# EasyEDA Pro project PCB4_1.epro

# Board PCB4_1
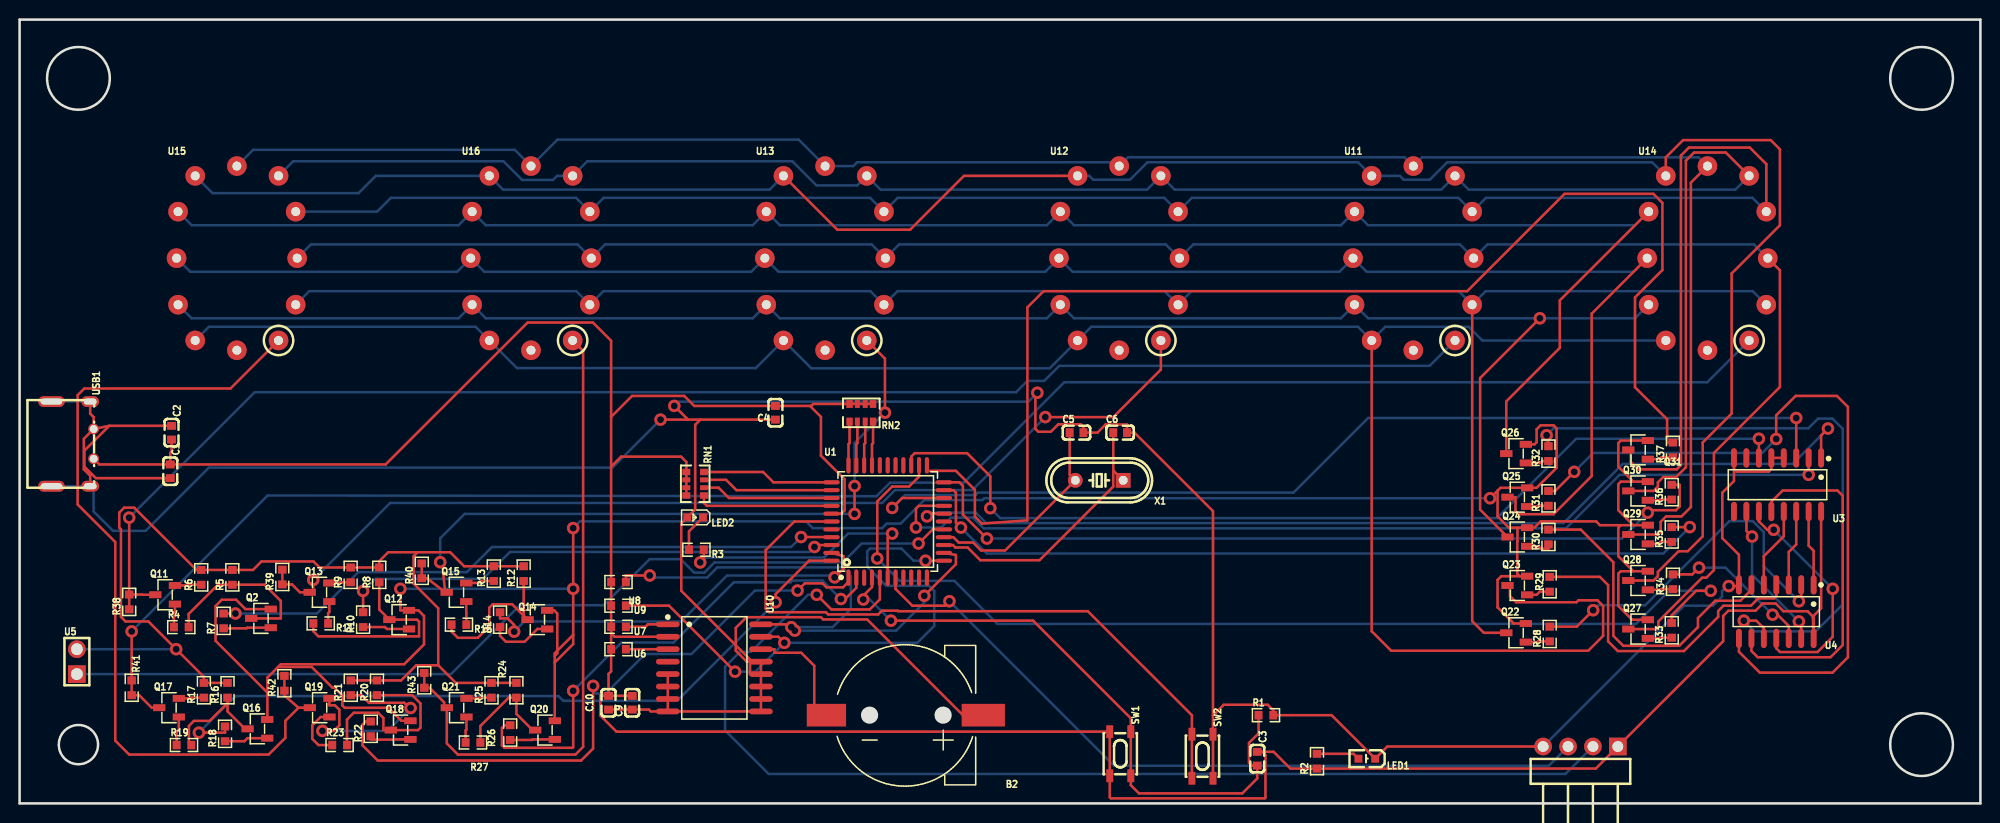
[diagram p0: board, top side]
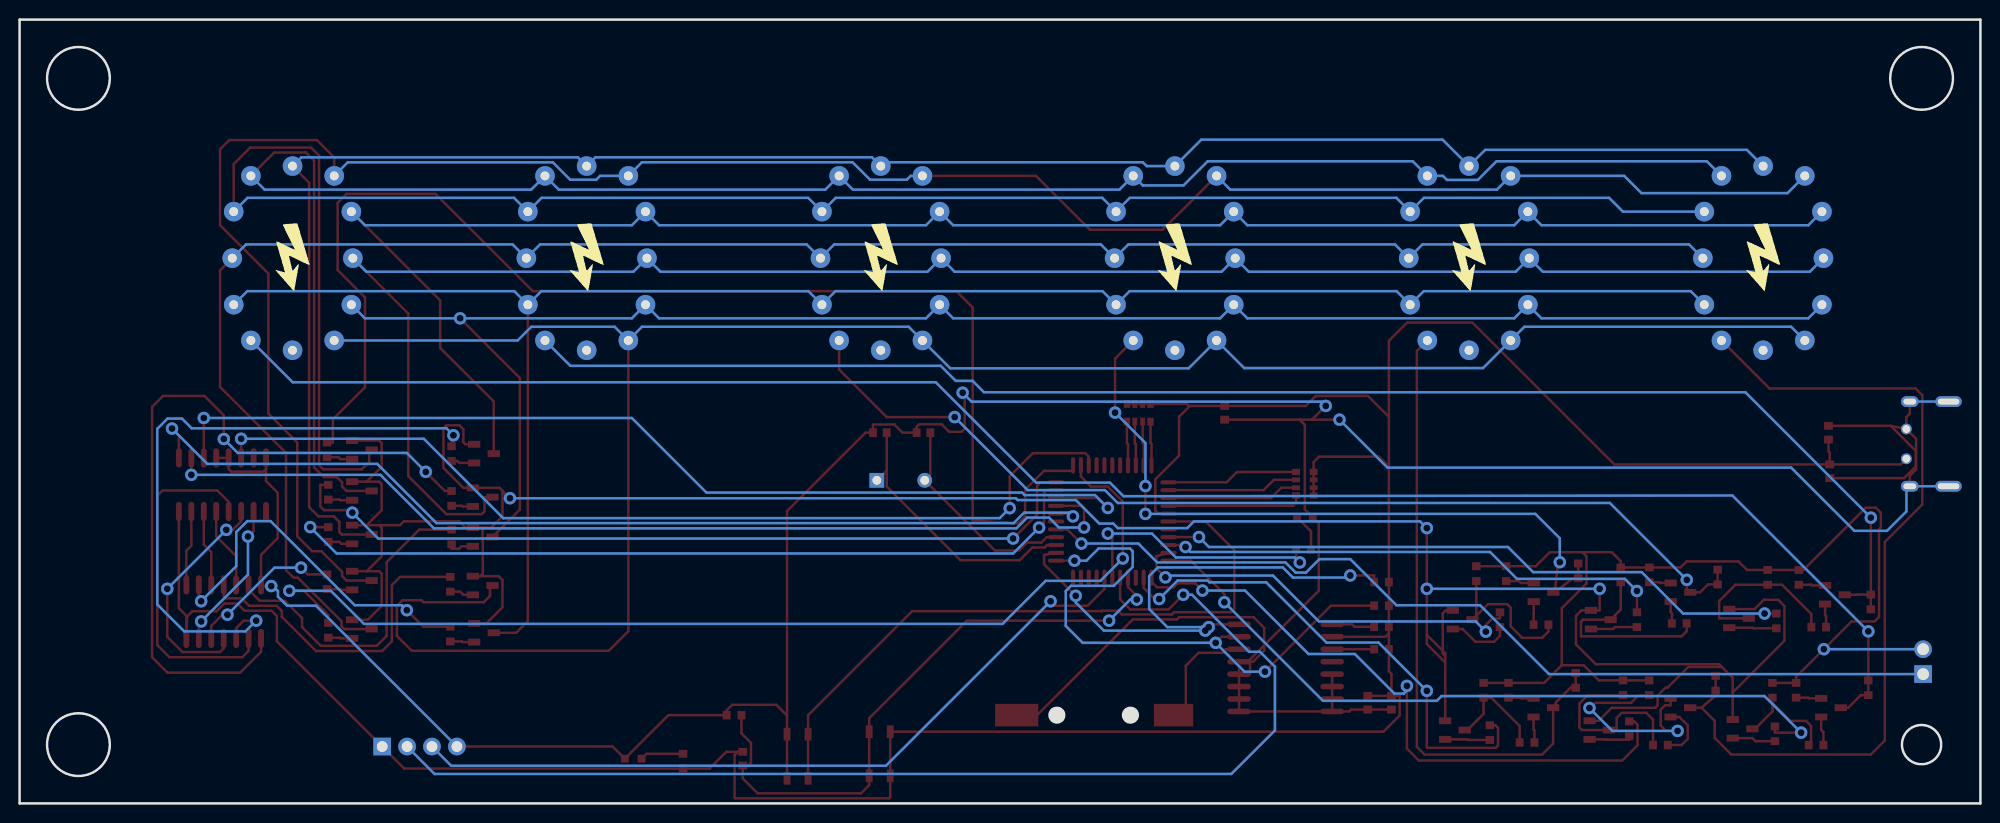
[diagram p1: board, bottom side, seen from below]

Outline 200 x 80 mm; copper layers: Top Layer, Bottom Layer. Coordinates in mm from the lower left corner of the outline.
Outline path: circle c6,74 r3.2 ; circle c6,6 r2 ; circle c86.7,9.01 r0.75 ; circle c94.2,9.01 r0.75 ; circle c194,74 r3.2 ; circle c194,6 r3.2 ; 0,80 0,0 200,0 200,80 0,80
Stack: Top Layer 0.0356mm / Dielectric1 0.32mm FR-4 er 4.8 / Bottom Layer 0.0356mm

## Design rules (mm)
spacing Clearance (default): track to track 0.254, other pairs 0 to 0.254
track width Width (default): min 0.254, default 0.254, max 0.254
differential pair DiffPairsRouting (default): width min 0.381, default 0.381, max 0.381; gap min 0.254, default 0.254
via RoutingVias (default): diameter min 1.27, default 1.27, max 1.27; hole min 0.711, default 0.711, max 0.711

## Placement (name value [footprint] x y rotation side)
B2  CR1220-2  [BAT-SMD_CR1220-2]  90.3 9.01 180 top
C1  CL10A106MP8NNNC  [C0603]  15.37 33.9 270 top
C2  CL10B104KB8NNNC  [C0603]  15.49 37.84 270 top
C3  CL10A106MP8NNNC  [C0603]  126.24 4.56 270 top
C4  CL10B104KB8NNNC  [C0603]  77.09 39.87 270 top
C5  0603CG220J500NT  [C0603]  107.81 37.84 0 top
C6  0603CG220J500NT  [C0603]  112.25 37.84 0 top
C9  CL10A105KB8NNNC  [C0603]  62.48 10.28 90 top
C10  CC0603KRX7R9BB104  [C0603]  60.07 10.28 90 top
H1  DZ254W-11-04-65  [HDR-TH_4P-P2.54-H-M-W10.3]  159.21 5.81 180 top
LED1  19-217/R6C-AL1M2VY/3T  [LED0603-R-RD]  137.41 4.56 180 top
LED2  LED_0603-B  [LED0603-RD_BLUE]  68.91 29.2 180 top
Q2  MMBTA42_C916394  [SOT-23-3_L2.9-W1.3-P1.90-LS2.4-BR]  24.62 18.88 0 top
Q11  MMBTA92_C916395  [SOT-23-3_L2.9-W1.3-P1.90-LS2.4-BR]  14.84 21.29 0 top
Q12  MMBTA42_C916394  [SOT-23-3_L2.9-W1.3-P1.90-LS2.4-BR]  38.72 18.75 0 top
Q13  MMBTA92_C916395  [SOT-23-3_L2.9-W1.3-P1.90-LS2.4-BR]  30.59 21.55 0 top
Q14  MMBTA42_C916394  [SOT-23-3_L2.9-W1.3-P1.90-LS2.4-BR]  52.81 18.75 0 top
Q15  MMBTA92_C916395  [SOT-23-3_L2.9-W1.3-P1.90-LS2.4-BR]  44.56 21.55 0 top
Q16  MMBTA42_C916394  [SOT-23-3_L2.9-W1.3-P1.90-LS2.4-BR]  24.26 7.61 0 top
Q17  MMBTA92_C916395  [SOT-23-3_L2.9-W1.3-P1.90-LS2.4-BR]  15.24 9.77 0 top
Q18  MMBTA42_C916394  [SOT-23-3_L2.9-W1.3-P1.90-LS2.4-BR]  38.86 7.48 0 top
Q19  MMBTA92_C916395  [SOT-23-3_L2.9-W1.3-P1.90-LS2.4-BR]  30.61 9.77 0 top
Q20  MMBTA42_C916394  [SOT-23-3_L2.9-W1.3-P1.90-LS2.4-BR]  53.59 7.48 0 top
Q21  MMBTA92_C916395  [SOT-23-3_L2.9-W1.3-P1.90-LS2.4-BR]  44.58 9.77 0 top
Q22  MMBTA42_C916394  [SOT-23-3_L2.9-W1.3-P1.90-LS2.4-BR]  152.64 17.41 0 top
Q23  MMBTA42_C916394  [SOT-23-3_L2.9-W1.3-P1.90-LS2.4-BR]  152.77 22.24 0 top
Q24  MMBTA42_C916394  [SOT-23-3_L2.9-W1.3-P1.90-LS2.4-BR]  152.77 27.19 0 top
Q25  MMBTA42_C916394  [SOT-23-3_L2.9-W1.3-P1.90-LS2.4-BR]  152.77 31.26 0 top
Q26  MMBTA42_C916394  [SOT-23-3_L2.9-W1.3-P1.90-LS2.4-BR]  152.64 35.7 0 top
Q27  MMBTA42_C916394  [SOT-23-3_L2.9-W1.3-P1.90-LS2.4-BR]  165.08 17.8 0 top
Q28  MMBTA42_C916394  [SOT-23-3_L2.9-W1.3-P1.90-LS2.4-BR]  165.08 22.75 0 top
Q29  MMBTA42_C916394  [SOT-23-3_L2.9-W1.3-P1.90-LS2.4-BR]  165.08 27.45 0 top
Q30  MMBTA42_C916394  [SOT-23-3_L2.9-W1.3-P1.90-LS2.4-BR]  165.08 31.89 0 top
Q31  MMBTA42_C916394  [SOT-23-3_L2.9-W1.3-P1.90-LS2.4-BR]  165.08 36.08 0 top
R1  RC0603JR-0710KL  [R0603]  127.13 9.01 0 top
R2  RC0603JR-0710KL  [R0603]  132.33 4.31 90 top
R3  RC0603JR-0710KL  [R0603]  69.03 25.89 180 top
R4  Res_0603  [R0603]  16.49 17.99 0 top
R5  Res_0603  [R0603]  21.7 23.07 90 top
R6  Res_0603  [R0603]  18.52 23.07 90 top
R7  Res_0603  [R0603]  20.81 18.63 90 top
R8  Res_0603  [R0603]  36.69 23.33 90 top
R9  Res_0603  [R0603]  33.76 23.33 90 top
R10  Res_0603  [R0603]  35.03 18.75 90 top
R11  Res_0603  [R0603]  30.72 18.37 180 top
R12  Res_0603  [R0603]  51.42 23.45 90 top
R13  Res_0603  [R0603]  48.37 23.45 90 top
R14  Res_0603  [R0603]  49 18.75 90 top
R15  Res_0603  [R0603]  44.81 18.25 180 top
R16  Res_0603  [R0603]  21.21 11.55 90 top
R17  Res_0603  [R0603]  18.8 11.55 90 top
R18  Res_0603  [R0603]  20.95 7.1 90 top
R19  Res_0603  [R0603]  16.76 5.96 0 top
R20  Res_0603  [R0603]  36.45 11.8 90 top
R21  Res_0603  [R0603]  33.78 11.8 90 top
R22  Res_0603  [R0603]  35.81 7.61 90 top
R23  Res_0603  [R0603]  32.64 5.96 0 top
R24  Res_0603  [R0603]  50.67 11.55 90 top
R25  Res_0603  [R0603]  48.13 11.55 90 top
R26  Res_0603  [R0603]  50.04 7.23 90 top
R27  Res_0603  [R0603]  46.24 6.22 0 top
R28  Res_0603  [R0603]  156.07 17.29 90 top
R29  Res_0603  [R0603]  156.07 22.37 90 top
R30  Res_0603  [R0603]  155.94 27.19 90 top
R31  Res_0603  [R0603]  155.94 31.13 90 top
R32  Res_0603  [R0603]  155.94 35.7 90 top
R33  Res_0603  [R0603]  168.51 17.67 90 top
R34  Res_0603  [R0603]  168.64 22.62 90 top
R35  Res_0603  [R0603]  168.51 27.45 90 top
R36  Res_0603  [R0603]  168.51 31.77 90 top
R37  Res_0603  [R0603]  168.64 36.08 90 top
R38  0603WAF1002T5E  [R0603]  11.18 20.56 90 top
R39  0603WAF1002T5E  [R0603]  26.8 23.1 90 top
R40  0603WAF1002T5E  [R0603]  41.02 23.74 90 top
R41  0603WAF1002T5E  [R0603]  11.43 11.8 270 top
R42  0603WAF1002T5E  [R0603]  27.01 12.26 90 top
R43  0603WAF1002T5E  [R0603]  41.27 12.56 90 top
RN1  yc164-jr-0710kl  [res-array-smd_0603-8p-l3.2-w1.6-bl]  68.91 32.62 270 top
RN2  yc164-jr-0710kl  [res-array-smd_0603-8p-l3.2-w1.6-bl]  85.85 39.87 180 top
SW1  PTS815SJK250SMTRLFS  [SW-SMD_4P-L4.2-W3.3-P2.15-LS5.1]  112.27 5.07 270 top
SW2  PTS815SJK250SMTRLFS  [SW-SMD_4P-L4.2-W3.3-P2.15-LS5.1]  120.65 4.82 270 top
U1  STC89C52RC-40I  [LQFP-44_L10.0-W10.0-P0.80-LS12.0-BL]  88.55 28.77 0 top
U3  74HC138D_C5205140  [SOIC-16_L9.9-W3.9-P1.27-LS6.0-BL]  179.31 32.53 180 top
U4  CD4069_C3041279  [SOP-14_L8.8-W3.9-P1.27-LS6.0-BL]  179.18 19.57 180 top
U5  54102-T0600LF  [HDR-TH_2P-P2.54-V-M-R2-C1-S2.54]  5.84 14.47 0 top
U6  AR03FTDX4701A  [R0603]  61.09 15.74 180 top
U7  AR03FTDX4701A  [R0603]  61.09 18.02 180 top
U8  AR03FTDX4701A  [R0603]  61.09 22.6 180 top
U9  AR03FTDX4701A  [R0603]  61.09 20.18 180 top
U10  DS3231SN#  [SOIC-16_L10.3-W7.5-P1.27-LS10.3-BL]  70.87 13.83 270 top
U11  IN-12A  [IN-12]  142.16 55.65 0 top
U12  IN-12A  [IN-12]  112.16 55.65 0 top
U13  IN-12A  [IN-12]  82.16 55.65 0 top
U14  IN-12A  [IN-12]  172.16 55.65 0 top
U15  IN-12A  [IN-12]  22.16 55.65 0 top
U16  IN-12A  [IN-12]  52.16 55.65 0 top
USB1  TYPE-C-31-M-33  [USB-C-TH_TYPE-C-31-M-33]  5.4 36.69 270 top
X1  B11059J019  [HC-49US_L11.5-W4.5-P4.88]  110.12 32.98 180 top

## Footprints (pads in the part's own frame, mm; a bottom-side part is the same pattern mirrored in y, then rotated)
BAT-SMD_CR1220-2
  rect 4.4x2.3 smd: 1(-8,0)
  rect 4x2.3 smd: 2(8,0)
C0603
  rect 0.8x0.9 smd: 1(-0.7,0) 2(0.7,0)
HC-49US_L11.5-W4.5-P4.88
  rect 1.501x1.501 hole 0.899: 1(-2.441,0)
  round 1.501 hole 0.899: 2(2.441,0)
HDR-TH_2P-P2.54-V-M-R2-C1-S2.54
  rect 1.8x1.8 hole 1.2: 1(0,-1.27)
  round 1.8 hole 1.2: 2(0,1.27)
HDR-TH_4P-P2.54-H-M-W10.3
  rect 1.8x1.8 hole 1.1: 1(-3.81,0)
  round 1.8 hole 1.1: 2(-1.27,0) 3(1.27,0) 4(3.81,0)
IN-12
  round 2 hole 0.914: Hi(4.25,-8.4) N0(6,-4.75) N1(-4.25,-8.4) N2(-6,-4.75) N3(-6.15,0) N4(-6,4.75) N5(-4.25,8.4) N6(0,9.4) N7(4.25,8.4) N8(6,4.75) N9(6.15,0) P(0,-9.4)
LED0603-R-RD
  rect 0.8x0.8 smd: 1(0.851,0) 2(-0.851,0)
LED0603-RD_BLUE
  rect 0.8x0.8 smd: 1(-0.8,-0.003) 2(0.8,0.003)
LQFP-44_L10.0-W10.0-P0.80-LS12.0-BL
  oval 0.419x1.669 smd: 1(-4,-5.736) 2(-3.2,-5.736) 3(-2.401,-5.736) 4(-1.6,-5.736) 5(-0.8,-5.736) 6(0,-5.736) 7(0.8,-5.736) 8(1.6,-5.736) 9(2.401,-5.736) 10(3.2,-5.736) 11(4,-5.736) 23(4,5.736) 24(3.2,5.736) 25(2.401,5.736) 26(1.6,5.736) 27(0.8,5.736) 28(0,5.736) 29(-0.8,5.736) 30(-1.6,5.736) 31(-2.401,5.736) 32(-3.2,5.736) 33(-4,5.736)
  oval 1.669x0.419 smd: 12(5.736,-4) 13(5.736,-3.2) 14(5.736,-2.401) 15(5.736,-1.6) 16(5.736,-0.8) 17(5.736,0) 18(5.736,0.8) 19(5.736,1.6) 20(5.736,2.401) 21(5.736,3.2) 22(5.736,4) 34(-5.736,4) 35(-5.736,3.2) 36(-5.736,2.401) 37(-5.736,1.6) 38(-5.736,0.8) 39(-5.736,0) 40(-5.736,-0.8) 41(-5.736,-1.6) 42(-5.736,-2.401) 43(-5.736,-3.2) 44(-5.736,-4)
R0603
  rect 0.806x0.864 smd: 1(-0.753,0) 2(0.753,0)
res-array-smd_0603-8p-l3.2-w1.6-bl
  rect 0.65x0.8 smd: 1(-1.199,-0.899) 4(1.199,-0.899) 5(1.199,0.899) 8(-1.199,0.899)
  rect 0.5x0.8 smd: 2(-0.399,-0.899) 3(0.402,-0.899) 6(0.402,0.899) 7(-0.399,0.899)
SOIC-16_L9.9-W3.9-P1.27-LS6.0-BL
  oval 0.602x1.971 smd: 1(-4.445,-2.736) 2(-3.175,-2.736) 3(-1.905,-2.736) 4(-0.635,-2.736) 5(0.635,-2.736) 6(1.905,-2.736) 7(3.175,-2.736) 8(4.445,-2.736) 9(4.445,2.736) 10(3.175,2.736) 11(1.905,2.736) 12(0.635,2.736) 13(-0.635,2.736) 14(-1.905,2.736) 15(-3.175,2.736) 16(-4.445,2.736)
SOIC-16_L10.3-W7.5-P1.27-LS10.3-BL
  oval 0.574x2.401 smd: 1(-4.445,-4.75) 2(-3.175,-4.75) 3(-1.905,-4.75) 4(-0.635,-4.75) 5(0.635,-4.75) 6(1.905,-4.75) 7(3.175,-4.75) 8(4.445,-4.75) 9(4.445,4.75) 10(3.175,4.75) 11(1.905,4.75) 12(0.635,4.75) 13(-0.635,4.75) 14(-1.905,4.75) 15(-3.175,4.75) 16(-4.445,4.75)
SOP-14_L8.8-W3.9-P1.27-LS6.0-BL
  oval 0.595x1.968 smd: 1(-3.81,-2.734) 2(-2.54,-2.734) 3(-1.27,-2.734) 4(0,-2.734) 5(1.27,-2.734) 6(2.54,-2.734) 7(3.81,-2.734) 8(3.81,2.733) 9(2.54,2.733) 10(1.27,2.733) 11(0,2.733) 12(-1.27,2.733) 13(-2.54,2.733) 14(-3.81,2.733)
SOT-23-3_L2.9-W1.3-P1.90-LS2.4-BR
  rect 1.25x0.7 smd: 1(1,-0.95) 2(1,0.95) 3(-1,0)
SW-SMD_4P-L4.2-W3.3-P2.15-LS5.1
  rect 1.3x0.701 smd: 1(-2.251,1.075) 2(2.251,1.075) 3(-2.251,-1.075) 4(2.251,-1.075)
USB-C-TH_TYPE-C-31-M-33
  oval 1.1x1.8 hole 0.6x1.3: 3(4.32,1.8) 6(-4.32,1.8)
  oval 1.1x2.7 hole 0.6x2.2: 4(4.32,-2.15) 5(-4.32,-2.15)
  round 1.1 hole 0.8: A9(1.52,2.15) B12(-1.52,2.15)

## Nets
+5V: C1.1 C2.2 C3.1 C4.1 C9.2 C10.2 H1.1 R2.1 RN1.1 RN1.2 RN1.3 RN1.4 RN2.1 RN2.2 RN2.3 RN2.4 SW1.3 SW1.4 U1.38 U3.16 U4.14 U6.2 U7.2 U8.2 U9.2 U10.2 USB1.A9
GND: U1.16 U5.1
GND1: Q2.2 Q12.2 Q14.2 Q16.2 Q18.2 Q20.2 Q22.2 Q23.2 Q24.2 Q25.2 Q26.2 Q27.2 Q28.2 Q29.2 Q30.2 Q31.2
GND2: B2.1 C1.2 C2.1 C4.2 C5.2 C6.2 C9.1 C10.1 H1.4 LED1.2 LED2.2 R1.2 SW2.1 SW2.2 U3.4 U3.5 U3.8 U4.7 U10.5 U10.6 U10.7 U10.8 U10.9 U10.10 U10.11 U10.12 U10.13 USB1.3 USB1.4 USB1.5 USB1.6 USB1.B12
VCC: R5.2 R6.2 R8.2 R9.2 R12.2 R13.2 R16.2 R17.2 R20.2 R21.2 R24.2 R25.2 U5.2
32K: U7.1 U10.1
BAT: B2.2 U10.14
CN0: R28.2 U4.2
CN1: R29.2 U4.4
CN2: R30.2 U4.6
CN3: R31.2 U4.8
CN4: R32.2 U4.10
CN5: R34.2 U4.12
HC0: U3.15 U4.1
HC1: U3.14 U4.3
HC2: U3.13 U4.5
HC3: U3.12 U4.9
HC4: U3.11 U4.11
HC5: U3.10 U4.13
HC6: U3.9
NO0: Q22.3 U11.N0 U12.N0 U13.N0 U14.N0 U15.N0 U16.N0
NO1: Q23.3 U11.N1 U12.N1 U13.N1 U14.N1 U15.N1 U16.N1
NO2: Q24.3 U11.N2 U12.N2 U13.N2 U14.N2 U15.N2 U16.N2
NO3: Q25.3 U11.N3 U12.N3 U13.N3 U14.N3 U15.N3 U16.N3
NO4: Q26.3 U11.N4 U12.N4 U13.N4 U14.N4 U15.N4 U16.N4
NO5: Q28.3 U11.N5 U12.N5 U13.N5 U14.N5 U15.N5 U16.N5
NO6: Q29.3 U11.N6 U12.N6 U13.N6 U14.N6 U15.N6 U16.N6
NO7: Q30.3 U11.N7 U12.N7 U13.N7 U14.N7 U15.N7 U16.N7
NO8: Q31.3 U11.N8 U12.N8 U13.N8 U14.N8 U15.N8 U16.N8
NO9: Q27.3 U11.N9 U12.N9 U13.N9 U14.N9 U15.N9 U16.N9
O1: Q11.3 R38.1 R38.2 U11.Hi
O2: Q13.3 R39.1 R39.2 U12.Hi
O3: Q15.3 R40.1 R40.2 U13.Hi
O4: Q17.3 R41.1 R41.2 U14.Hi
O5: Q19.3 R42.1 R42.2 U15.Hi
O6: Q21.3 R43.1 R43.2 U16.Hi
P0.0: RN1.5 U1.37
P0.1: RN1.6 U1.36
P0.2: RN1.7 U1.35
P0.3: RN1.8 U1.34
P0.4: RN2.5 U1.33
P0.5: RN2.6 U1.32
P0.6: RN2.7 U1.31
P0.7: RN2.8 U1.30
P1.0: U1.40
P1.1: R7.2 U1.41
P1.2: R10.2 U1.42
P1.3: R14.2 U1.43
P1.4: R18.2 U1.44
P1.5: R22.2 U1.1
P1.6: R26.2 U1.2
P1.7: U1.3
P2.0: U1.18 U3.1
P2.1: U1.19 U3.2
P2.2: U1.20 U3.3
P2.3: R35.2 U1.21
P2.4: R36.2 U1.22
P2.5: R37.2 U1.23
P2.6: R33.2 U1.24
P2.7: U1.25 U3.6
P3.0: H1.2 U1.5
P3.1: H1.3 U1.7
P3.2: U1.8
P3.3: U1.9
P3.4: U1.10
P3.5: U1.11
P3.6: U1.12 U9.1 U10.15
P3.7: U1.13 U8.1 U10.16
P4.0: U1.17
P4.1: U1.28
P4.2: SW2.3 SW2.4 U1.39
P4.3: R3.1 U1.6
P4.4: U1.26
P4.5: U1.27
P4.6: U1.29
RST: C3.2 R1.1 SW1.1 SW1.2 U1.4
SQW: U6.1 U10.3
XTAL1: C5.1 U1.15 X1.2
XTAL2: C6.1 U1.14 X1.1
$1N1351: LED1.1 R2.2
$1N1355: LED2.1 R3.2
$1N2619: Q11.2 R6.1
$1N2621: Q2.1 R7.1
$1N2624: Q2.3 R4.2 R5.1
$1N2625: Q11.1 R4.1
$1N3048: Q13.2 R9.1
$1N3050: Q12.1 R10.1
$1N3052: Q12.3 R8.1 R11.2
$1N3053: Q13.1 R11.1
$1N3261: Q15.2 R13.1
$1N3263: Q14.1 R14.1
$1N3265: Q14.3 R12.1 R15.2
$1N3266: Q15.1 R15.1
$1N3474: Q17.2 R17.1
$1N3476: Q16.1 R18.1
$1N3478: Q16.3 R16.1 R19.2
$1N3479: Q17.1 R19.1
$1N3687: Q19.2 R21.1
$1N3689: Q18.1 R22.1
$1N3691: Q18.3 R20.1 R23.2
$1N3692: Q19.1 R23.1
$1N3900: Q21.2 R25.1
$1N3902: Q20.1 R26.1
$1N3904: Q20.3 R24.1 R27.2
$1N3905: Q21.1 R27.1
$1N4218: Q22.1 R28.1
$1N4332: Q23.1 R29.1
$1N4415: Q24.1 R30.1
$1N4498: Q25.1 R31.1
$1N4581: Q26.1 R32.1
$1N4664: Q27.1 R33.1
$1N4747: Q28.1 R34.1
$1N4830: Q29.1 R35.1
$1N4913: Q30.1 R36.1
$1N4996: Q31.1 R37.1

Pads without a net: U3 7; U10 4; U11 P; U12 P; U13 P; U14 P; U15 P; U16 P

## Via types
v1: diameter 1.27, hole 0.711, Top Layer to Bottom Layer, 72 vias

## Routing (per net, layer and track width the routed paths; a pad name or vN(x,y) marks a point on that pad's centre or on a via; arc(x,y) is an arc through that point)
+5V: length 325.5
  Top Layer w0.254: C1.1 15.37,35.8 15.49,35.92 C2.2 ; C1.1 37.33,34.6 51.82,49.08 58.47,49.08 60.33,47.22 60.33,39.45 ; C1.1 8.12,34.6 7.55,35.17 ; C10.2 C9.2 ; C10.2 59.23,10.98 59.23,8.97 60.88,7.32 111.19,7.32 SW1.3 SW1.4 111.19,0.64 111.32,0.52 127,0.52 127.08,0.59 127.08,4.93 126.75,5.26 ; C10.2 60.07,13.22 60.33,13.48 U6.2 60.33,17.36 ; 126.75,5.26 127.91,5.26 129.62,3.55 R2.1 160.77,3.55 H1.1 173.76,16.55 173.76,19.13 174.3,19.67 177.06,19.67 177.8,20.4 179.12,20.4 179.91,19.62 182.37,19.62 182.91,19.08 ; 126.75,5.26 C3.1 ; 60.33,17.36 60.68,17.01 U10.2 ; 60.33,17.36 U7.2 U9.2 U8.2 60.33,34.37 ; 60.33,34.37 61.35,35.39 67.46,35.39 68.01,34.85 RN1.1 RN1.2 RN1.3 RN1.4 ; 60.33,34.37 60.33,39.45 ; 182.91,19.08 U4.14 182.99,19 182.91,19.08 ; 182.91,19.08 183.75,19.92 U3.16 ; 80.62,40.57 80.75,40.57 80.95,40.77 87.05,40.77 ; 80.62,40.57 81.74,39.45 81.74,35.49 84.15,33.08 84.15,29.9 83.82,29.57 U1.38 ; 80.62,40.57 C4.1 68.81,40.57 67.79,41.59 62.47,41.59 60.33,39.45
GND: length 95.7
  Top Layer w0.254: v1(91.69,26.53) 93.14,27.97 94.28,27.97
  Bottom Layer w0.254: v1(91.69,26.53) 85.89,26.53 83.96,24.59 70.88,24.59 69.84,23.56 68.79,23.56 67.42,24.93 64.27,24.93 59.56,20.23 51.03,20.23 44,13.2 U5.1
GND1: length 287.2
  Top Layer w0.254: Q20.2 54.58,8.43 54.58,14.38 ; Q14.2 54.52,19.7 54.84,19.39 54.84,15.58 ; v1(56.46,28.1) v1(56.46,21.9) 56.46,17.2 ; 164.59,23.7 163.32,23.7 163.07,23.44 163.07,20.15 164.47,18.75 Q27.2 ; 164.59,23.7 163.07,25.22 163.07,28.14 163.32,28.4 ; 164.59,23.7 Q28.2 ; 152.78,28.14 151.9,28.14 150.75,29.29 150.75,31.91 ; 152.78,28.14 Q24.2 154.51,28.14 155.15,28.79 160.81,28.79 161.2,28.4 163.32,28.4 ; 152.78,28.14 152.78,26.75 152.76,26.73 152.76,23.45 153.02,23.19 ; 150.75,31.91 151.05,32.21 Q25.2 154.73,32.21 156.77,34.25 156.77,38.29 156.46,38.59 155.14,38.59 154.74,38.18 154.74,36.86 154.53,36.65 Q26.2 ; 150.75,31.91 v1(149.99,31.15) ; 26.36,13.93 25.27,12.84 25.27,11.31 ; 26.36,13.93 26.64,14.21 39.23,14.21 41.25,16.23 41.25,19.13 40.68,19.7 Q12.2 38.84,19.7 v1(38.84,21.9) ; 26.36,13.93 29.79,13.93 31.9,11.82 32.11,11.82 32.92,11.01 32.92,10 33.16,9.76 37.61,9.76 38.93,8.43 Q18.2 ; 153.02,23.19 151.13,23.19 150.75,22.81 150.75,20.02 152.4,18.36 Q22.2 ; 153.02,23.19 Q23.2 ; 54.84,15.58 56.46,17.2 ; 54.84,15.58 54.58,15.32 54.58,15.04 ; 54.84,15.58 54.84,15.3 54.58,15.04 ; 56.46,17.2 56.46,16.26 54.58,14.38 ; Q2.2 23.03,19.83 22.08,20.78 20.62,20.78 19.99,20.15 19.99,16.59 25.27,11.31 ; Q31.2 163.32,37.03 163.07,36.78 163.07,34.37 164.59,32.84 ; 54.58,14.38 54.58,15.04 ; 164.59,32.84 163.32,32.84 163.07,32.59 163.07,29.92 164.59,28.4 ; 164.59,32.84 Q30.2 ; 163.32,28.4 164.59,28.4 ; 164.59,28.4 Q29.2 ; Q16.2 25.27,8.56 25.27,11.31
  Bottom Layer w0.254: v1(38.84,21.9) v1(56.46,21.9) ; v1(149.99,31.15) 98.38,31.15 98.2,30.96 92.27,30.96 89.87,28.56 88.45,28.56 87.99,28.1 80.9,28.1 80.21,28.79 57.15,28.79 v1(56.46,28.1)
GND2: length 387.7
  Top Layer w0.254: U10.12 74.5,13.2 74.5,14.47 ; U10.12 U10.13 74.5,14.47 ; U10.12 U10.11 U10.10 U10.9 U10.8 ; 69.44,39.17 C4.2 ; 69.44,39.17 68.91,38.64 68.91,30 LED2.2 67.49,28.58 67.49,21.7 73.05,16.14 ; 69.44,39.17 68.18,39.17 ; U10.8 U10.7 U10.6 U10.5 ; U10.8 64.38,9.39 64.19,9.58 C9.1 C10.1 ; C1.2 7.78,33.2 6.6,34.37 6.6,36 9.14,38.54 ; USB1.6 7.2,39.78 7.55,39.43 7.55,38.21 ; 74.5,14.47 74.17,14.47 73.05,15.59 73.05,16.14 ; 74.5,14.47 74.5,14.69 73.05,16.14 ; 7.2,32.37 7.2,33.45 6.55,34.09 6.55,37.22 7.55,38.21 ; U3.4 U3.5 178.67,34.12 178.42,33.87 175.12,33.87 174.86,34.12 ; 7.55,38.21 9.14,38.54 ; 9.14,38.54 C2.1 ; 73.05,16.14 73.05,17.91 74.14,19.01 81.74,19.01 81.97,18.78 86.45,18.78 96.22,9.01 B2.1 ; v1(174.33,22.18) 175.37,22.18 U4.7 175.37,25.37 173.67,27.07 173.67,31.71 174.86,32.9 174.86,34.12 ; v1(103.81,41.92) 103.61,41.71 103.61,38.23 103.91,37.93 105.18,37.93 105.94,38.69 108.25,38.69 108.51,38.44 C5.2 109.94,37.84 110.77,38.67 112.95,38.67 C6.2 113.72,37.84 121.72,29.83 121.72,8.97 ; 68.18,39.17 v1(66.78,40.57) ; 68.18,39.17 v1(65.37,39.17) ; H1.4 139.51,5.81 LED1.2 133.82,9.01 R1.2 127.88,9.49 127.3,10.07 122.82,10.07 121.72,8.97 ; 174.86,34.12 U3.8 ; 121.72,8.97 SW2.1 SW2.2
  Bottom Layer w0.254: USB1.5 USB1.6 ; H1.4 169.77,20.18 172.72,20.18 173.65,21.11 173.65,21.67 174.16,22.18 v1(174.33,22.18) ; v1(103.81,41.92) 102.9,41 67.21,41 v1(66.78,40.57) ; 3.25,32.37 7.54,32.37 7.54,29.8 9.52,27.82 12.85,27.82 19.3,34.27 60.48,34.27 v1(65.37,39.17)
VCC: length 112.2
  Top Layer w0.254: R21.2 R20.2 38.92,12.55 40.46,14.1 42.7,14.1 ; 42.7,14.1 42.7,19.92 40.18,22.44 40.18,25.23 40.59,25.64 ; 42.7,14.1 44.5,12.3 R25.2 R24.2 ; 40.59,25.64 43.92,25.64 45.35,24.21 R13.2 R12.2 ; 40.59,25.64 37.6,25.64 36.69,24.72 R8.2 R9.2 30.59,24.08 29.97,24.7 24.67,24.7 23.8,23.83 R5.2 R6.2 18.04,23.83 11.68,30.18 10.67,30.18 10.16,29.67 10.16,28.15 10.34,27.97 10.34,19.03 10.79,18.57 13.13,18.57 v1(15.97,15.74) 18.8,12.91 R17.2 R16.2
  Bottom Layer w0.254: U5.2 v1(15.97,15.74)
32K: length 4.4
  Top Layer w0.254: U7.1 63.83,18.02 64.08,18.28 U10.1
BAT: length 12.6
  Top Layer w0.254: B2.2 81.05,9.01 81.05,14.05 79.73,15.38 76.99,15.38 76.99,15.74 U10.14
CN0: length 37.1
  Top Layer w0.254: U4.2 181.72,20.87 v1(181.48,20.63) ; R28.2 158.82,18.04 v1(160.5,19.72)
  Bottom Layer w0.254: v1(181.48,20.63) 177.9,24.21 177.9,27.69 176.78,28.81 174.4,28.81 165.81,20.23 161.01,20.23 v1(160.5,19.72)
CN1: length 33.4
  Top Layer w0.254: U4.4 179.18,21.15 178.96,20.93 177.34,20.93 176.59,20.18 173.79,20.18 173.25,19.64 173.25,19.04 169.77,15.55 163.02,15.55 162.03,16.54 162.03,22.28 161.19,23.12 R29.2
CN2: length 33.4
  Top Layer w0.254: R30.2 159.23,27.95 162.56,24.62 162.56,17.1 163.58,16.09 169.28,16.09 171.19,18 171.19,18.92 172.95,20.68 175.51,20.68 176.64,21.81 U4.6
CN3: length 76
  Top Layer w0.254: v1(179.17,37.19) 179.17,39.61 181.15,41.59 185.37,41.59 186.49,40.47 186.49,14.92 184.91,13.34 177.51,13.34 175.37,15.48 U4.8 ; v1(158.57,33.84) 156.62,31.88 R31.2
  Bottom Layer w0.254: v1(158.57,33.84) 160.5,35.77 177.75,35.77 v1(179.17,37.19)
CN4: length 65.5
  Top Layer w0.254: v1(155.75,37.57) 155.94,37.39 R32.2 ; v1(175.87,18.65) 177.14,18.65 177.91,17.88 U4.10
  Bottom Layer w0.254: v1(175.87,18.65) 176.96,17.56 183.21,17.56 185.96,20.31 185.96,38.23 184.91,39.28 183.44,39.28 182.45,38.29 156.46,38.29 v1(155.75,37.57)
CN5: length 15.8
  Top Layer w0.254: R34.2 170.61,23.37 v1(171.3,24.06) ; v1(178.8,19.26) 179.31,19.26 180.45,18.12 U4.12
  Bottom Layer w0.254: v1(171.3,24.06) 174,24.06 v1(178.8,19.26)
HC0: length 7.7
  Top Layer w0.254: U4.1 182.99,25.79 182.48,26.3 U3.15
HC1: length 7.8
  Top Layer w0.254: U4.3 180.45,25.66 181.21,26.42 U3.14
HC2: length 8.3
  Top Layer w0.254: U4.5 177.91,25.23 179.94,27.26 U3.13
HC3: length 35.6
  Top Layer w0.254: U4.9 176.64,15.57 177.29,14.92 184.71,14.92 185.96,16.17 185.96,31.4 185.42,31.94 179.83,31.94 178.67,30.78 U3.12
HC4: length 23.9
  Top Layer w0.254: v1(178.92,27.92) 178.27,27.92 177.4,28.79 U3.11 ; U4.11 179.18,15.83 179.56,15.45 183.39,15.45 184.94,17 v1(184.94,21.9)
  Bottom Layer w0.254: v1(178.92,27.92) v1(184.94,21.9)
HC5: length 15.3
  Top Layer w0.254: U4.13 181.72,18.34 v1(181.48,18.57) ; v1(176.71,27.24) 176.13,27.81 U3.10
  Bottom Layer w0.254: v1(181.48,18.57) 176.71,23.35 v1(176.71,27.24)
NO0: length 192
  Top Layer w0.254: U11.N0 148.16,18.6 149.35,17.41 Q22.3
  Bottom Layer w0.254: U15.N0 29.54,52.28 56.78,52.28 U16.N0 59.54,52.28 86.78,52.28 U13.N0 89.54,52.28 116.78,52.28 U12.N0 119.54,52.28 146.78,52.28 U11.N0 149.54,52.28 176.78,52.28 U14.N0
NO1: length 227.4
  Top Layer w0.254: U11.N1 137.91,17.57 139.9,15.58 159.99,15.58 161.52,17.1 161.52,20.15 160.93,20.73 159,20.73 158.8,20.53 152.65,20.53 152.02,21.17 152.02,22.24 Q23.3
  Bottom Layer w0.254: U14.N1 149.2,47.25 147.8,48.65 139.31,48.65 U11.N1 136.51,48.65 109.31,48.65 U12.N1 105.07,44.41 80.75,44.41 77.91,47.25 75.09,44.43 50.73,44.43 U16.N1 46.51,48.65 19.31,48.65 U15.N1
NO2: length 181.7
  Top Layer w0.254: Q24.3 148.97,29.99 148.97,43.42 v1(155.07,49.51)
  Bottom Layer w0.254: U14.N2 164.77,49.51 v1(155.07,49.51) 137.55,49.51 U11.N2 134.77,49.51 107.55,49.51 U12.N2 104.77,49.51 77.55,49.51 U13.N2 74.77,49.51 47.55,49.51 U16.N2 44.77,49.51 17.55,49.51 16.16,50.9
NO3: length 192.1
  Top Layer w0.254: 166.01,55.65 160.35,49.99 160.35,33.41 156.46,29.52 152.86,29.52 152.58,29.8 152.58,31.26 Q25.3
  Bottom Layer w0.254: 166.01,55.65 164.62,54.26 137.4,54.26 136.01,55.65 134.62,54.26 107.4,54.26 106.01,55.65 104.62,54.26 77.4,54.26 76.01,55.65 74.62,54.26 47.4,54.26 U16.N3 44.62,54.26 17.4,54.26 U15.N3
NO4: length 186.5
  Top Layer w0.254: 151.64,35.7 151.64,41.03 157.1,46.49 157.1,51.34 U14.N4
  Bottom Layer w0.254: 16.16,60.4 17.55,59.01 44.77,59.01 U16.N4 47.55,59.01 74.77,59.01 U13.N4 77.55,59.01 104.77,59.01 U12.N4 107.55,59.01 134.77,59.01 U11.N4 137.55,59.01 164.77,59.01 U14.N4
NO5: length 227.2
  Top Layer w0.254: 77.91,64.05 83.41,58.56 90.83,58.56 96.33,64.05 U12.N5 ; U14.N5 167.91,65.94 169.67,67.7 178.61,67.7 179.55,66.76 179.55,59.01 174.62,54.08 174.62,39.78 171.68,36.84 171.68,27.26 170.15,25.74 169.21,25.74 167.11,23.63 167.11,23.2 166.66,22.75 Q28.3
  Bottom Layer w0.254: U14.N5 166.53,65.43 145.61,65.43 143.84,63.66 141.18,63.66 140.79,64.05 U11.N5 136.52,65.44 115.04,65.44 113.26,63.66 109.5,63.66 109.11,64.05 U12.N5 ; 77.91,64.05 76.5,62.64 49.32,62.64 U16.N5 36.33,64.05 34.57,62.29 19.67,62.29 U15.N5
NO6: length 199.3
  Top Layer w0.254: U14.N6 170.47,63.36 170.47,30.24 169.52,29.29 167.94,29.29 167.39,28.73 167.39,27.7 167.13,27.45 Q29.3
  Bottom Layer w0.254: U15.N6 23.82,66.71 50.5,66.71 U16.N6 54.86,67.75 79.46,67.75 U13.N6 85.04,65.05 85.43,65.44 112.16,65.44 U12.N6 113.06,65.95 141.26,65.95 U11.N6 143.05,65.94 171.27,65.94 U14.N6
NO7: length 203.3
  Top Layer w0.254: U14.N7 174.03,66.43 170.79,66.43 169.96,65.6 169.96,34.31 168.96,33.31 167.64,33.31 167.11,32.77 167.11,32.34 166.66,31.89 Q30.3
  Bottom Layer w0.254: U15.N7 27.9,65.54 49.35,65.54 51.26,63.64 54.41,63.64 54.82,64.05 U16.N7 57.9,65.54 78.82,65.54 81.28,63.08 85.44,63.08 U13.N7 87.82,62.64 115.01,62.64 U12.N7 117.82,62.64 145,62.64 U11.N7 147.82,62.64 175,62.64 U14.N7
NO8: length 209.1
  Top Layer w0.254: U14.N8 178.16,65.25 176.48,66.94 170.27,66.94 169.45,66.12 169.45,34.53 169.02,34.09 165.1,34.09 164.34,34.86 164.34,36.08 Q31.3
  Bottom Layer w0.254: U14.N8 176.75,61.81 149.57,61.81 U11.N8 146.75,61.81 119.57,61.81 U12.N8 116.76,61.81 89.57,61.81 U13.N8 86.76,61.81 59.57,61.81 U16.N8 56.75,61.81 37.87,61.81 36.47,60.4 U15.N8
NO9: length 202.5
  Top Layer w0.254: Q27.3 166.88,17.8 167.16,18.07 167.16,18.57 171.62,23.03 172.05,23.03 172.82,23.81 172.82,35.77 179.55,42.5 179.55,54.41 U14.N9
  Bottom Layer w0.254: U15.N9 29.72,57.06 56.9,57.06 U16.N9 59.72,57.06 86.9,57.06 U13.N9 89.72,57.06 116.9,57.06 U12.N9 119.72,57.06 146.9,57.06 U11.N9 149.72,57.06 176.9,57.06 U14.N9
O1: length 154.8
  Top Layer w0.254: Q11.3 12.52,21.29 12.5,21.32 R38.2 ; R38.2 R38.1 ; R38.2 v1(11.18,29.17)
  Bottom Layer w0.254: v1(11.18,29.17) 23.98,41.97 101.64,41.97 102.79,43.13 104.51,43.13 106.05,44.66 143.82,44.66 U11.Hi
O2: length 104.6
  Top Layer w0.254: v1(29.95,22.82) 29.95,21.55 Q13.3 28.59,21.55 27.79,22.35 R39.1 R39.2 ; v1(104.62,39.43) 111.56,39.43 116.41,44.28 U12.Hi
  Bottom Layer w0.254: v1(29.95,22.82) 37.8,30.67 87.99,30.67 89.3,31.98 97.17,31.98 v1(104.62,39.43)
O3: length 73.2
  Top Layer w0.254: v1(85.17,29.55) v1(85.17,32.39) ; v1(42.9,24.62) 43.1,24.42 43.41,21.55 ; R40.2 R40.1 41.55,22.99 43.41,21.55 ; 43.41,21.55 Q15.3 ; v1(88.27,39.89) 88.27,45.4 U13.Hi
  Bottom Layer w0.254: v1(85.17,32.39) 85.17,36.79 v1(88.27,39.89) ; v1(42.9,24.62) 42.9,27.06 45.39,29.55 v1(85.17,29.55)
O4: length 187.2
  Top Layer w0.254: Q17.3 13.47,9.77 12.19,11.05 R41.2 R41.1 v1(11.43,17.56)
  Bottom Layer w0.254: U14.Hi 172.15,42.98 106.55,42.98 96.31,32.74 88.79,32.74 87.4,31.36 84.15,31.36 25.3,31.43 v1(11.43,17.56)
O5: length 87
  Top Layer w0.254: 28.45,9.77 27.01,11.01 R42.1 R42.2 ; 28.45,9.77 Q19.3 ; 28.45,9.77 27.1,8.42 27.1,6.69 25.4,4.99 11.18,4.99 9.75,6.41 9.75,26.68 5.92,30.51 5.92,41.66 6.6,42.35 21.51,42.35 U15.Hi
O6: length 65.2
  Top Layer w0.254: R43.2 R43.1 41.81,11.81 43.31,10.31 43.31,9.77 Q21.3 43.58,6.11 44.7,4.99 56.69,4.99 57.48,5.77 57.48,46.18 U16.Hi
P0.0: length 13.9
  Top Layer w0.254: U1.37 70.1,30.37 69.8,30.67 RN1.5
P0.1: length 13.4
  Top Layer w0.254: RN1.6 71.3,32.22 72.35,31.17 U1.36
P0.2: length 13.4
  Top Layer w0.254: RN1.7 72.06,33.02 73.12,31.97 U1.35
P0.3: length 13.4
  Top Layer w0.254: U1.34 76.89,32.77 75.84,33.82 RN1.8
P0.4: length 4.5
  Top Layer w0.254: U1.33 84.55,36.66 84.65,36.77 84.65,38.97
P0.5: length 4.5
  Top Layer w0.254: 85.45,38.97 85.45,36.77 85.34,36.66 U1.32
P0.6: length 4.5
  Top Layer w0.254: 86.25,38.97 86.25,36.77 86.14,36.66 U1.31
P0.7: length 4.5
  Top Layer w0.254: 86.95,34.51 86.95,36.66 87.05,36.77 87.05,38.97
P1.1: length 65.2
  Top Layer w0.254: 20.81,19.38 v1(22.01,19.38) ; v1(79.7,27.19) 82.08,27.19 82.81,27.17
  Bottom Layer w0.254: v1(22.01,19.38) 30.32,19.38 34.54,23.6 45.62,23.6 48.18,26.17 78.69,26.17 v1(79.7,27.19)
P1.2: length 51.9
  Top Layer w0.254: R10.2 v1(35.03,21.68) ; U1.42 81.28,26.37 v1(81.08,26.17)
  Bottom Layer w0.254: v1(81.08,26.17) 80.57,25.66 50.01,25.66 47.27,22.92 36.27,22.92 v1(35.03,21.68)
P1.3: length 42
  Top Layer w0.254: v1(50.44,17.53) 50.44,18.22 49.78,18.88 49,18.88 R14.2 ; U1.43 84.05,25.23 84.05,23.99 v1(83.13,23.07)
  Bottom Layer w0.254: v1(83.13,23.07) 82.95,23.25 72.15,23.25 67.47,18.57 51.49,18.57 v1(50.44,17.53)
P1.4: length 76
  Top Layer w0.254: 20.95,7.85 20.95,7.22 v1(18.29,7.22) ; v1(77.11,20.53) 77.11,21.36 80.52,24.77 U1.44
  Bottom Layer w0.254: v1(77.11,20.53) 67.05,10.47 55.45,10.47 54.96,10.96 22.02,10.96 v1(18.29,7.22)
P1.5: length 66.3
  Top Layer w0.254: U1.1 84.55,22.61 83.99,22.06 82.3,22.06 81.89,22.46 80.09,22.46 v1(79.35,21.73) ; v1(58.5,12) 58.5,5.6 57.28,4.38 36.52,4.38 34.98,5.93 34.98,8.03 35.31,8.36 35.81,8.36
  Bottom Layer w0.254: v1(79.35,21.73) 75.01,21.73 68.53,15.25 63.8,15.25 59.77,11.21 58.8,11.21 58.5,11.51 v1(58.5,12)
P1.6: length 51.7
  Top Layer w0.254: v1(83.77,20.86) 84.2,20.86 85.34,22 U1.2 ; v1(56.46,11.49) 56.46,5.75 56.39,5.67 49.45,5.67 49.2,5.93 49.2,7.7 49.48,7.98 R26.2
  Bottom Layer w0.254: v1(83.77,20.86) 81.89,22.74 78.82,22.74 78.64,22.56 72.85,22.56 66.7,16.42 61.39,16.42 v1(56.46,11.49)
P2.0: length 101.6
  Top Layer w0.254: U3.1 183.75,37.56 v1(184.45,38.26) ; v1(92.56,29.29) 92.83,29.57 U1.18
  Bottom Layer w0.254: v1(184.45,38.26) 180.85,34.65 163.52,34.65 157.48,28.61 98.6,28.61 97.54,29.67 92.94,29.67 v1(92.56,29.29)
P2.1: length 100.8
  Top Layer w0.254: v1(182.48,33.54) U3.2 ; U1.19 91.72,30.37 91.43,30.08 v1(91.43,28.16)
  Bottom Layer w0.254: v1(91.43,28.16) 93.99,28.16 95,29.17 97.23,29.17 98.32,28.08 157.73,28.08 163.19,33.54 v1(182.48,33.54)
P2.2: length 105.8
  Top Layer w0.254: v1(89,30.16) 90.02,31.17 U1.20 ; U3.3 v1(181.21,39.34)
  Bottom Layer w0.254: v1(89,30.16) 90.31,31.47 97.49,31.47 97.74,31.72 129.94,31.72 137.55,39.34 v1(181.21,39.34)
P2.3: length 83.5
  Top Layer w0.254: v1(96.01,28.15) 95.5,28.66 95.5,31.72 95.25,31.97 U1.21 ; R35.2 170.36,28.2
  Bottom Layer w0.254: v1(170.36,28.2) 167.67,25.51 98.65,25.51 v1(96.01,28.15)
P2.4: length 83.5
  Top Layer w0.254: U1.22 95.86,32.77 96.21,32.42 96.21,29.48 v1(98.67,27.03) ; v1(166.06,29.67) 166.32,29.93 168.95,29.93 169.33,30.31 169.33,32.52 R36.2
  Bottom Layer w0.254: v1(98.67,27.03) 163.42,27.03 v1(166.06,29.67)
P2.5: length 133.9
  Top Layer w0.254: U1.23 92.55,33.94 95.5,33.94 97.44,32.01 97.44,29.28 98.16,28.56 102.79,28.89 102.79,50.63 104.45,52.28 147.65,52.28 157.58,62.21 166.65,62.21 167.56,61.3 167.56,54.44 164.77,51.65 164.77,42.48 168.05,39.2 168.05,36.84 R37.2
P2.6: length 107.3
  Top Layer w0.254: v1(172.49,21.7) 171,21.7 168.51,19.21 R33.2 ; U1.24 91.75,33.36 90.73,32.34 89,32.34 87.48,30.82 v1(87.48,25)
  Bottom Layer w0.254: v1(87.48,25) 89.76,22.72 95.34,22.72 99.73,18.32 164.87,18.32 168.25,21.7 v1(172.49,21.7)
P2.7: length 97.5
  Top Layer w0.254: v1(99.01,30.13) 99.01,33.38 96.65,35.75 91.3,35.75 90.95,35.39 U1.25 ; U3.6 v1(177.4,37.22)
  Bottom Layer w0.254: v1(177.4,37.22) 158.78,37.22 150.67,29.12 100.02,29.12 v1(99.01,30.13)
P3.0: length 120.1
  Top Layer w0.254: v1(81.31,21.29) 82.8,19.79 86.72,19.79 87.74,20.82 87.74,23.04
  Bottom Layer w0.254: H1.2 157.68,3 76.4,3 71.96,7.45 71.96,13.95 73.48,15.48 74.6,15.48 80.42,21.29 v1(81.31,21.29)
P3.1: length 78.4
  Top Layer w0.254: v1(94.84,20.63) 94.39,20.18 91.06,20.18 89.35,21.89 U1.7
  Bottom Layer w0.254: H1.3 155.98,3.84 111.63,3.84 v1(94.84,20.63)
P3.6: length 60.3
  Top Layer w0.254: U9.1 66.24,20.18 v1(72.97,13.44) ; v1(92.4,24.77) U1.12 ; U10.15 77.39,17.01 v1(78,16.39)
  Bottom Layer w0.254: v1(72.97,13.44) 75.06,13.44 v1(78,16.39) 91.57,16.39 93.29,18.12 93.29,21.67 92.76,22.21 88.39,22.21 86.46,24.14 86.46,25.74 86.74,26.02 89.94,26.02 91.19,24.77 v1(92.4,24.77)
P3.7: length 60.2
  Top Layer w0.254: U8.1 61.84,23.27 v1(64.27,23.27) ; v1(79.07,17.64) v1(78.71,17.99) 78.43,18.28 U10.16 ; U1.13 95.5,25.36 95.5,24.42 v1(92.28,21.19)
  Bottom Layer w0.254: v1(78.71,17.99) 82.93,17.99 84.79,19.84 84.79,23.2 83.9,24.09 71.16,24.09 70.12,23.05 64.49,23.05 v1(64.27,23.27) ; v1(79.07,17.64) 89.41,17.64 92.28,20.51 v1(92.28,21.19)
P4.2: length 68.6
  Top Layer w0.254: SW2.4 SW2.3 119.58,9 108.96,19.62 89.61,19.62 89.56,19.67 87.96,19.67 87.58,19.29 82.47,19.29 82.24,19.52 76.45,19.52 76.1,19.87 76.1,25.85 79.02,28.77 U1.39
P4.3: length 26.9
  Top Layer w0.254: R3.1 69.79,24.96 v1(69.42,24.59) ; U1.6 88.55,27.09 v1(89,27.54)
  Bottom Layer w0.254: v1(69.42,24.59) 69.93,25.1 82.07,25.1 84.51,27.54 v1(89,27.54)
RST: length 63.1
  Top Layer w0.254: R1.1 126.37,7.15 125.4,6.18 125.4,4.15 125.69,3.86 C3.2 126.24,2.55 124.72,1.03 114.18,1.03 113.34,1.86 SW1.2 SW1.1 113.34,8.69 103.38,18.65 v1(88.87,18.65) ; v1(86.05,20.81) 86.05,21.19 86.95,22.08 86.95,23.04
  Bottom Layer w0.254: v1(86.05,20.81) 86.72,20.81 v1(88.87,18.65)
SQW: length 4.3
  Top Layer w0.254: U6.1 U10.3
XTAL1: length 22
  Top Layer w0.254: 94.28,27.17 95.24,27.17 95.78,26.63 97.26,26.63 98.07,25.81 100.52,25.81 X1.2 107.11,33.55 C5.1
XTAL2: length 28
  Top Layer w0.254: 111.55,33.99 111.55,32.34 104.03,24.82 97.99,24.82 96.7,26.12 95.45,26.12 95.2,26.37 U1.14 ; 111.55,33.99 C6.1 ; 111.55,33.99 X1.1
$1N1351: length 4.4
  Top Layer w0.254: LED1.1 136.06,5.06 R2.2
$1N1355: length 3.9
  Top Layer w0.254: LED2.1 68.28,27.77 R3.2
$1N2619: length 2.7
  Top Layer w0.254: Q11.2 17.14,22.24 17.22,22.32 R6.1
$1N2621: length 4.8
  Top Layer w0.254: Q2.1 23.22,17.93 23.16,17.87 R7.1
$1N2624: length 17.5
  Top Layer w0.254: Q2.3 26.64,18.88 26.64,20.66 24.98,22.32 R5.1 20.23,22.32 17.25,19.34 R4.2
$1N2625: length 2.4
  Top Layer w0.254: 15.74,17.99 15.74,19.11 15.84,19.21 Q11.1
$1N3048: length 2.2
  Top Layer w0.254: Q13.2 32.64,22.5 32.71,22.57 33.76,22.57
$1N3050: length 4.8
  Top Layer w0.254: R10.1 37.26,18 37.46,17.8 Q12.1
$1N3052: length 20.7
  Top Layer w0.254: 36.69,22.57 36.69,19.79 Q12.3 40.54,18.75 40.74,18.55 40.74,17.05 30.48,17.05 29.96,17.57 29.96,18.37
$1N3053: length 2.3
  Top Layer w0.254: Q13.1 31.59,19.53 31.47,19.41 R11.1
$1N3261: length 2.9
  Top Layer w0.254: R13.1 47.06,22.7 46.86,22.5 Q15.2
$1N3263: length 6.5
  Top Layer w0.254: R14.1 49,17.1 49.61,16.5 51.5,16.5 52.81,17.8 Q14.1
$1N3265: length 15.5
  Top Layer w0.254: 51.42,19.15 R12.1 ; 51.42,19.15 50.24,20.33 48.26,20.33 47.9,19.97 47.9,18.07 46.74,16.9 44.7,16.9 44.06,17.54 R15.2 ; 51.42,19.15 Q14.3
$1N3266: length 2.4
  Top Layer w0.254: R15.1 45.57,19.41 45.56,19.42 Q15.1
$1N3474: length 2.6
  Top Layer w0.254: Q17.2 17.47,10.72 17.55,10.79 R17.1
$1N3476: length 4.4
  Top Layer w0.254: Q16.1 23.25,6.66 22.94,6.35 R18.1
$1N3478: length 11.3
  Top Layer w0.254: 21.21,10.24 R16.1 ; 21.21,10.24 19.38,8.42 17.78,8.42 17.27,7.91 17.27,6.18 17.52,6.18 R19.2 ; 21.21,10.24 21.21,9.39 22.99,7.61 Q16.3
$1N3479: length 3
  Top Layer w0.254: Q17.1 16.24,7.5 16.01,7.27 R19.1
$1N3687: length 22.1
  Top Layer w0.254: v1(39.88,9.74) 39.77,9.74 39.24,10.26 35.63,10.26 34.85,11.05 R21.1 ; v1(30.89,7.4) 32.05,7.4 32.61,7.96 32.61,9.56 32.16,10.02 31.6,10.02 31.6,10.72 Q19.2
  Bottom Layer w0.254: v1(30.89,7.4) 37.54,7.4 v1(39.88,9.74)
$1N3689: length 4.4
  Top Layer w0.254: Q18.1 38.17,6.53 38.15,6.51 35.81,6.51 R22.1
$1N3691: length 19.2
  Top Layer w0.254: R20.1 40.04,11.05 40.89,10.19 40.89,7.74 40.64,7.48 Q18.3 37.1,7.48 37.1,8.72 36.58,9.25 34.08,9.25 33.39,8.56 R23.2
$1N3692: length 5.8
  Top Layer w0.254: R23.1 30.48,5.96 29.85,6.59 29.85,7.97 30.7,8.82 Q19.1
$1N3900: length 2.6
  Top Layer w0.254: Q21.2 46.81,10.72 46.89,10.79 R25.1
$1N3902: length 4.6
  Top Layer w0.254: Q20.1 52.33,6.53 52.27,6.48 R26.1
$1N3904: length 10.8
  Top Layer w0.254: Q20.3 52.32,7.48 50.67,9.13 R24.1 49.89,10.79 47,7.91 R27.2
$1N3905: length 2.6
  Top Layer w0.254: R27.1 45.49,7.45 45.58,7.54 Q21.1
$1N4218: length 2.5
  Top Layer w0.254: R28.1 154.88,16.53 154.81,16.46 Q22.1
$1N4332: length 2.4
  Top Layer w0.254: R29.1 155.06,21.61 154.74,21.29 Q23.1
$1N4415: length 2.7
  Top Layer w0.254: R30.1 155.94,25.99 155.18,25.99 154.93,26.24 Q24.1
$1N4498: length 2.2
  Top Layer w0.254: R31.1 154.88,30.38 154.81,30.31 Q25.1
$1N4581: length 2.4
  Top Layer w0.254: R32.1 155.35,34.95 155.16,34.75 Q26.1
$1N4664: length 2.5
  Top Layer w0.254: Q27.1 167.26,16.84 167.33,16.91 R33.1
$1N4747: length 2.6
  Top Layer w0.254: Q28.1 167.31,21.8 167.38,21.87 R34.1
$1N4830: length 2.5
  Top Layer w0.254: Q29.1 167.18,26.5 167.38,26.69 R35.1
$1N4913: length 2.5
  Top Layer w0.254: R36.1 167.33,31.01 167.26,30.94 Q30.1
$1N4996: length 2.6
  Top Layer w0.254: Q31.1 167.26,35.13 167.46,35.33 R37.1
